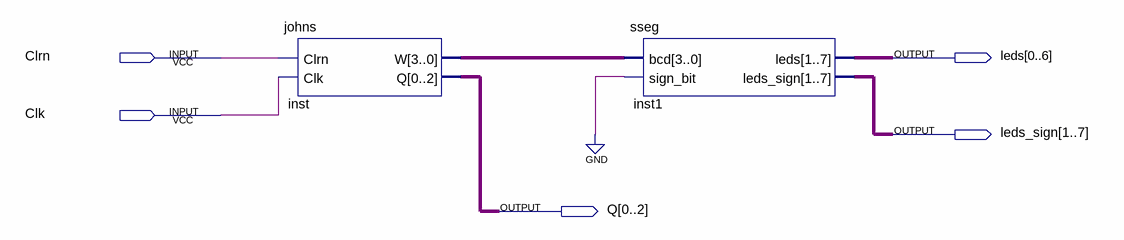
[diagram p0: schematic sheet]
// Quartus schematic johnsonCounter.bdf as structural Verilog: 2 symbols, 5 pins
module johnsonCounter (
  input  Clrn,
  input  Clk,
  output [0:6] leds,
  output [1:7] leds_sign,
  output [0:2] Q
);

  wire [3:0] inst_w;

  johns inst (.Clrn(Clrn), .Clk(Clk), .W(inst_w), .Q(Q));
  sseg inst1 (.bcd(inst_w), .sign_bit(1'b0), .leds(leds), .leds_sign(leds_sign));
endmodule
